# EAGLE design res (EAGLE 6.5.0)
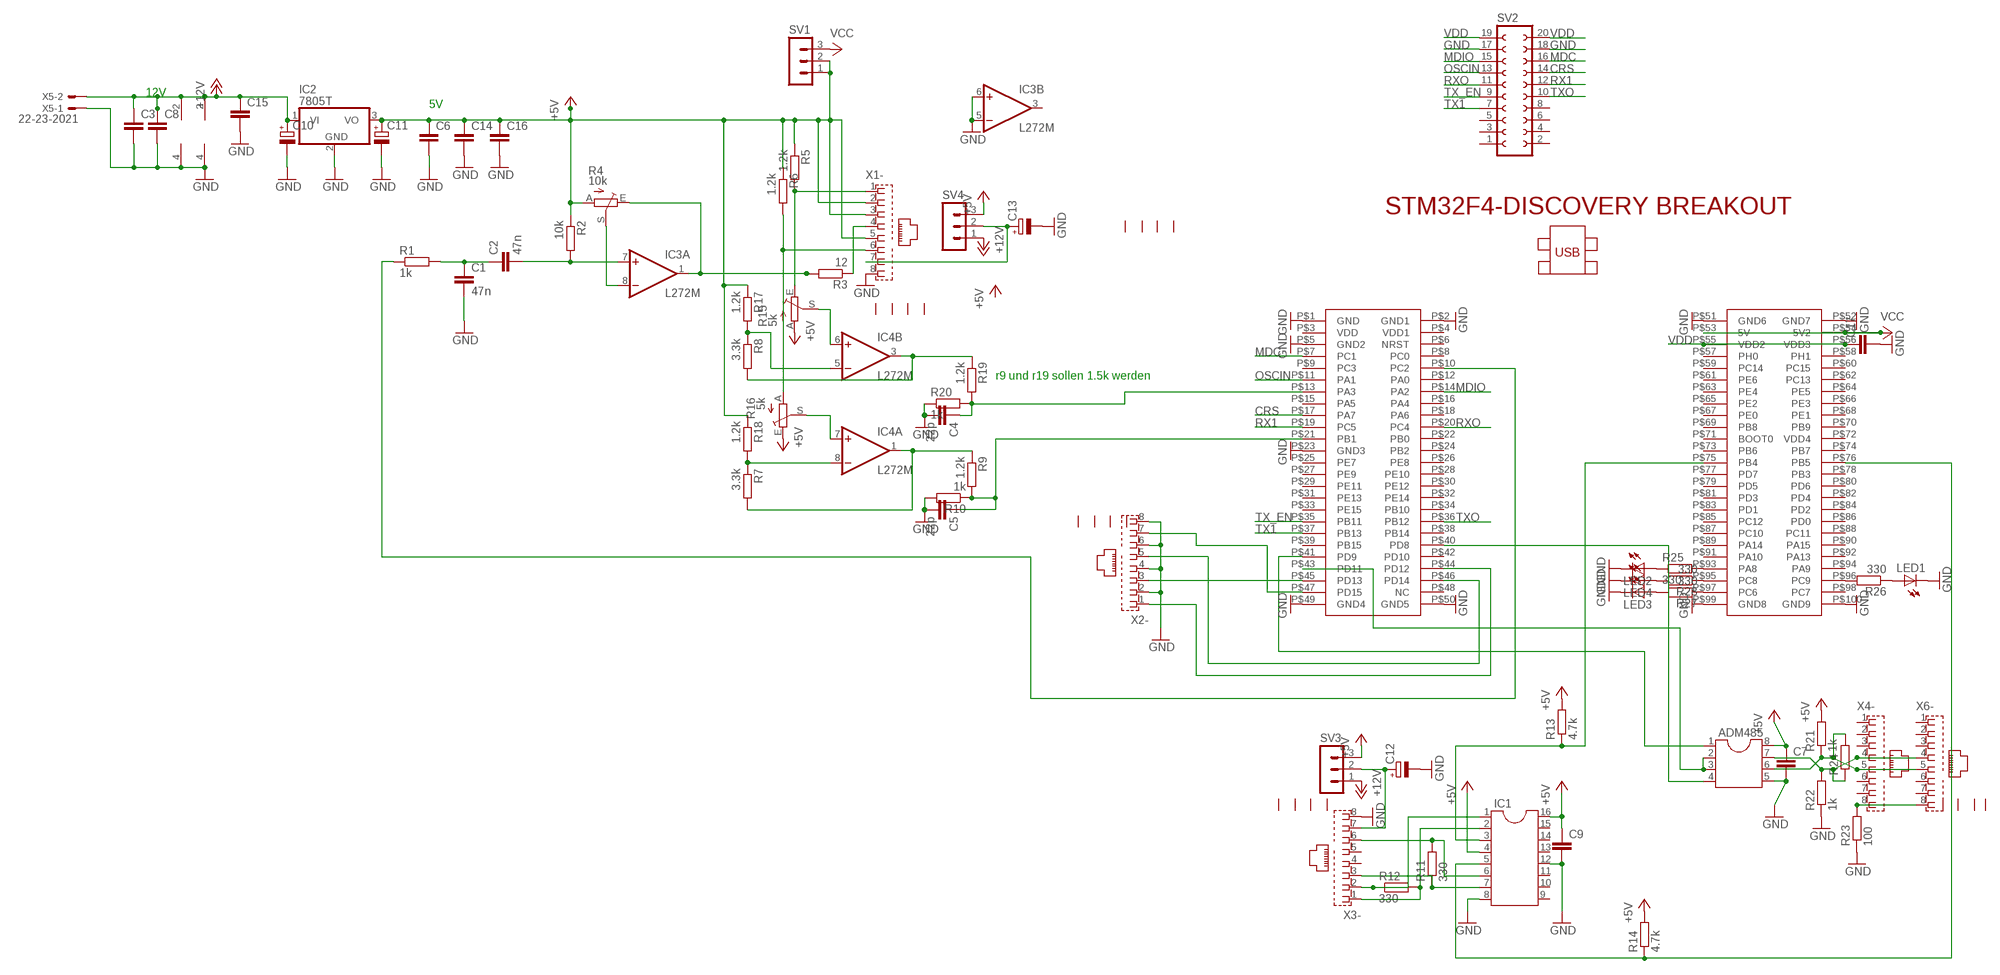
[diagram p0: schematic, sheet 1]

## Parts
ADM485  DIL8  [DIL08]
C1  47n  C-EU050-025X075  [C050-025X075]
C2  47n  C-EU050-025X075  [C050-025X075]
C3  C-EU050-025X075  [C050-025X075]
C4  22p  C-EU050-025X075  [C050-025X075]
C5  22p  C-EU050-025X075  [C050-025X075]
C6  C-EU050-025X075  [C050-025X075]
C7  C-EU050-025X075  [C050-025X075]
C8  C-EU050-025X075  [C050-025X075]
C9  C-EU050-025X075  [C050-025X075]
C10  CPOL-EUE2.5-5  [E2,5-5]
C11  CPOL-EUE2.5-5  [E2,5-5]
C12  CPOL-EUE2.5-5  [E2,5-5]
C13  CPOL-EUE2.5-5  [E2,5-5]
C14  C-EU050-025X075  [C050-025X075]
C15  C-EU050-025X075  [C050-025X075]
C16  C-EU050-025X075  [C050-025X075]
C17  C-EU050-025X075  [C050-025X075]
IC1  DIL16  [DIL16]
IC2  7805T  [TO220H]
IC3  L272M  [DIL08]
IC4  L272M  [DIL08]
LED1  LED3MM  [LED3MM]
LED2  LED3MM  [LED3MM]
LED3  LED3MM  [LED3MM]
LED4  LED3MM  [LED3MM]
R1  1k  R-EU_0204/7  [0204/7]
R2  10k  R-EU_0204/7  [0204/7]
R3  12  R-EU_0204/7  [0204/7]
R4  10k  TRIM_EU-CA6V  [CA6V]
R5  1.2k  R-EU_0204/7  [0204/7]
R6  1.2k  R-EU_0204/7  [0204/7]
R7  3.3k  R-EU_0204/7  [0204/7]
R8  3.3k  R-EU_0204/7  [0204/7]
R9  1.2k  R-EU_0204/7  [0204/7]
R10  1k  R-EU_0204/7  [0204/7]
R11  330  R-EU_0204/7  [0204/7]
R12  330  R-EU_0204/7  [0204/7]
R13  4.7k  R-EU_0204/7  [0204/7]
R14  4.7k  R-EU_0204/7  [0204/7]
R15  5k  TRIM_EU-CA6V  [CA6V]
R16  5k  TRIM_EU-CA6V  [CA6V]
R17  1.2k  R-EU_0204/7  [0204/7]
R18  1.2k  R-EU_0204/7  [0204/7]
R19  1.2k  R-EU_0204/7  [0204/7]
R20  1k  R-EU_0204/7  [0204/7]
R21  1k  R-EU_0204/7  [0204/7]
R22  1k  R-EU_0204/7  [0204/7]
R23  100  R-EU_0204/7  [0204/7]
R24  R-EU_0204/7  [0204/7]
R25  330  R-EU_0204/7  [0204/7]
R26  330  R-EU_0204/7  [0204/7]
R27  330  R-EU_0204/7  [0204/7]
R28  330  R-EU_0204/7  [0204/7]
SV1  MA03-1  [MA03-1]
SV2  FE10-2W  [FE10-2W]
SV3  MA03-1  [MA03-1]
SV4  MA03-1  [MA03-1]
U$1  STM32F4-DISCOVERY  [STM32F4-DISCOVERY]
X1  RJ45  [RJ45]
X2  RJ45  [RJ45]
X3  RJ45  [RJ45]
X4  RJ45  [RJ45]
X5  22-23-2021  [22-23-2021]
X6  RJ45  [RJ45]

## Nets
+5V: ADM485.8 C6.1 C7.1 C9.1 C11.+ C14.1 C16.1 IC1.4 IC1.16 IC2.3(VO) R2.1 R4.A R5.1 R6.1 R13.2 R14.2 R15.A R16.E R17.1 R18.1 R21.2 SV1.1 SV1.2 SV3.3 SV4.3 X1.2 X1.3 X1.5
+12V: C3.1 C8.1 C10.+ C15.1 IC2.1(VI) IC3.2(P:V+) IC4.2(P:V+) SV3.1 SV4.1 X5.2
CRS: SV2.14 U$1.P$17(PA7)
GND: ADM485.5 C1.2 C3.2 C4.2 C5.2 C6.2 C7.2 C8.2 C9.2 C10.- C11.- C12.- C13.- C14.2 C15.2 C16.2 C17.2 IC1.8 IC1.12 IC2.2(GND) IC3.4(P:GND) IC3.5(B:-IN) IC3.6(B:+IN) IC4.4(P:GND) LED1.K(C) LED2.K(C) LED3.K(C) LED4.K(C) R10.2 R20.1 R22.1 R23.1 SV2.17 SV2.18 U$1.P$1(GND) U$1.P$2(GND1) U$1.P$5(GND2) U$1.P$23(GND3) U$1.P$49(GND4) U$1.P$50(GND5) U$1.P$51(GND6) U$1.P$52(GND7) U$1.P$99(GND8) U$1.P$100(GND9) X1.8 X2.2 X2.4 X2.6 X2.8 X3.8 X5.1
MDC: SV2.16 U$1.P$7(PC1)
MDIO: SV2.15 U$1.P$14(PA2)
N$1: IC3.8(A:-IN) R4.S
N$2: IC3.1(A:OUT) R3.2 R4.E
N$3: C2.2 IC3.7(A:+IN) R2.2
N$4: R1.1 U$1.P$10(PC2)
N$5: C1.1 C2.1 R1.2
N$6: R3.1 X1.4
N$8: R6.2 R16.A X1.6
N$9: R5.2 R15.E X1.1
N$10: IC4.5(B:-IN) R8.1 R17.2
N$11: IC4.8(A:-IN) R7.1 R18.2
N$12: IC4.3(B:OUT) R8.2 R19.1
N$13: IC4.1(A:OUT) R7.2 R9.1
N$14: U$1.P$47(PD15) X2.7
N$15: C12.+ SV3.2 X3.7
N$16: U$1.P$44(PD12) X2.1
N$17: IC1.6 R11.2 X3.6
N$18: U$1.P$46(PD14) X2.5
N$19: U$1.P$45(PD13) X2.3
N$20: C4.1 R19.2 R20.2 U$1.P$13(PA3)
N$21: IC4.6(B:+IN) R15.S
N$22: IC1.3 R13.1 U$1.P$75(PB4)
N$23: IC1.5 R14.1 U$1.P$76(PB5)
N$24: IC1.2 R12.2 X3.1
N$25: IC1.1 R12.1 X3.2
N$26: IC1.7 R11.1 X3.3
N$27: C13.+ SV4.2 X1.7
N$28: IC4.7(A:+IN) R16.S
N$37: ADM485.4 U$1.P$40(PD8)
N$40: C5.1 R9.2 R10.1 U$1.P$21(PB1)
N$41: ADM485.1 U$1.P$41(PD9)
N$42: ADM485.2 ADM485.3 U$1.P$43(PD11)
N$43: ADM485.6 R21.1 R24.2 X4.5 X6.5
N$44: ADM485.7 R22.2 R24.1 X4.4 X6.4
N$45: R23.2 X4.8 X6.8
N$46: LED2.A R25.1
N$47: R26.2 U$1.P$96(PC9)
N$48: R27.1 U$1.P$97(PC6)
N$49: R28.1 U$1.P$95(PC8)
N$50: LED1.A R26.1
N$51: R25.2 U$1.P$93(PA8)
N$52: LED3.A R27.2
N$53: LED4.A R28.2
OSCIN: SV2.13 U$1.P$11(PA1)
RX1: SV2.12 U$1.P$19(PC5)
RXO: SV2.11 U$1.P$20(PC4)
TX1: SV2.7 U$1.P$37(PB13)
TX_EN: SV2.9 U$1.P$35(PB11)
TXO: SV2.10 U$1.P$36(PB12)
VCC: SV1.3 U$1.P$53(5V) U$1.P$54(5V2)
VDD: C17.1 SV2.19 SV2.20 U$1.P$55(VDD2) U$1.P$56(VDD3)
Unconnected: IC1.9 IC1.10 IC1.11 IC1.13 IC1.14 IC1.15 IC3.3(B:OUT) SV2.1 SV2.2 SV2.3 SV2.4 SV2.5 SV2.6 SV2.8 U$1.P$3(VDD) U$1.P$4(VDD1) U$1.P$6(NRST) U$1.P$8(PC0) U$1.P$9(PC3) U$1.P$12(PA0) U$1.P$15(PA5) U$1.P$16(PA4) U$1.P$18(PA6) U$1.P$22(PB0) U$1.P$24(PB2) U$1.P$25(PE7) U$1.P$26(PE8) U$1.P$27(PE9) U$1.P$28(PE10) U$1.P$29(PE11) U$1.P$30(PE12) U$1.P$31(PE13) U$1.P$32(PE14) U$1.P$33(PE15) U$1.P$34(PB10) U$1.P$38(PB14) U$1.P$39(PB15) U$1.P$42(PD10) U$1.P$48(NC) U$1.P$57(PH0) U$1.P$58(PH1) U$1.P$59(PC14) U$1.P$60(PC15) U$1.P$61(PE6) U$1.P$62(PC13) U$1.P$63(PE4) U$1.P$64(PE5) U$1.P$65(PE2) U$1.P$66(PE3) U$1.P$67(PE0) U$1.P$68(PE1) U$1.P$69(PB8) U$1.P$70(PB9) U$1.P$71(BOOT0) U$1.P$72(VDD4) U$1.P$73(PB6) U$1.P$74(PB7) U$1.P$77(PD7) U$1.P$78(PB3) U$1.P$79(PD5) U$1.P$80(PD6) U$1.P$81(PD3) U$1.P$82(PD4) U$1.P$83(PD1) U$1.P$84(PD2) U$1.P$85(PC12) U$1.P$86(PD0) U$1.P$87(PC10) U$1.P$88(PC11) U$1.P$89(PA14) U$1.P$90(PA15) U$1.P$91(PA10) U$1.P$92(PA13) U$1.P$94(PA9) U$1.P$98(PC7) X1.G1 X1.G2 X1.G3 X1.G4 X2.G1 X2.G2 X2.G3 X2.G4 X3.4 X3.5 X3.G1 X3.G2 X3.G3 X3.G4 X4.1 X4.2 X4.3 X4.6 X4.7 X4.G1 X4.G2 X4.G3 X4.G4 X6.1 X6.2 X6.3 X6.6 X6.7 X6.G1 X6.G2 X6.G3 X6.G4

## Notes on the sheet
- 12V
- 5V
- r9 und r19 sollen 1.5k werden

## Library data of the parts
ADM485 = ic-package:DIL8: Dual In Line / Socket
C1-C9 C14-C17 = rcl:C-EU: CAPACITOR, European symbol
C10-C13 = rcl:CPOL-EU: POLARIZED CAPACITOR, European symbol
IC1 = ic-package:DIL16: Dual In Line / Socket
IC2 = linear:78*: Positive VOLTAGE REGULATOR Source: http://cache.national.com/ds/LM/LM78L05.pdf http://www.fairchildsemi.com/ds/LM/LM7805.pdf
IC3 IC4 = linear:L272: OP AMP
LED1-LED4 = led:LED: LED OSRAM: - CHIPLED LG R971, LG N971, LY N971, LG Q971, LY Q971, LO R971, LY R971 LH N974, LH R974 LS Q976, LO Q976, LY Q976 LO Q996 - Hyper CHIPLED LW Q18S LB Q993, LB Q99A, LB R99A - SideLED LS A670, LO A670, LY A670, LG A670, LP A670 LB A673, LV A673, LT A673, LW A673 LH A674 LY A675 LS A676, LA A676, LO A676, LY A676, LW A676 LS A679, LY A679, LG A679 - Hyper Micro SIDELED® LS Y876, LA Y876, LO Y876, LY Y876 LT Y87S - SmartLED LW L88C, LW L88S LB L89C, LB L89S, LG L890 LS L89K, LO L89K, LY L89K LS L896, LA L896, LO L896, LY L896 - TOPLED LS T670, LO T670, LY T670, LG T670, LP T670 LSG T670, LSP T670, LSY T670, LOP T670, LYG T670 LG T671, LOG T671, LSG T671 LB T673, LV T673, LT T673, LW T673 LH T674 LS T676, LA T676, LO T676, LY T676, LB T676, LH T676, LSB T676, LW T676 LB T67C, LV T67C, LT T67C, LS T67K, LO T67K, LY T67K, LW E67C LS E67B, LA E67B, LO E67B, LY E67B, LB E67C, LV E67C, LT E67C LW T67C LS T679, LY T679, LG T679 LS T770, LO T770, LY T770, LG T770, LP T770 LB T773, LV T773, LT T773, LW T773 LH T774 LS E675, LA E675, LY E675, LS T675 LS T776, LA T776, LO T776, LY T776, LB T776 LHGB T686 LT T68C, LB T68C - Hyper Mini TOPLED® LB M676 - Mini TOPLED Santana® LG M470 LS M47K, LO M47K, LY M47K Source: http://www.osram.convergy.de LUXEON: - LUMILED® LXK2-PW12-R00, LXK2-PW12-S00, LXK2-PW14-U00, LXK2-PW14-V00 LXK2-PM12-R00, LXK2-PM12-S00, LXK2-PM14-U00 LXK2-PE12-Q00, LXK2-PE12-R00, LXK2-PE12-S00, LXK2-PE14-T00, LXK2-PE14-U00 LXK2-PB12-K00, LXK2-PB12-L00, LXK2-PB12-M00, LXK2-PB14-N00, LXK2-PB14-P00, LXK2-PB14-Q00 LXK2-PR12-L00, LXK2-PR12-M00, LXK2-PR14-Q00, LXK2-PR14-R00 LXK2-PD12-Q00, LXK2-PD12-R00, LXK2-PD12-S00 LXK2-PH12-R00, LXK2-PH12-S00 LXK2-PL12-P00, LXK2-PL12-Q00, LXK2-PL12-R00 Source: www.luxeon.com KINGBRIGHT: KA-3528ASYC Source: www.kingbright.com
R1-R3 R5-R14 R17-R28 = resistor:R-EU_: RESISTOR, European symbol
R4 R15 R16 = pot:TRIM_EU-: POTENTIOMETER
SV1 SV3 SV4 = con-lstb:MA03-1: PIN HEADER; OC_FARNELL: unknown; OC_NEWARK: unknown
SV2 = con-lsta:FE10-2W: FEMALE HEADER; OC_FARNELL: unknown; OC_NEWARK: unknown
U$1 = STM32F4-DISCOVERY:STM32F4-DISCOVERY
X1-X4 X6 = con-appsys:RJ45: AMP connector
X5 = con-molex:22-23-2021: .100" (2.54mm) Center Header - 2 Pin; MF: MOLEX; MPN: 22-23-2021; OC_FARNELL: 1462926; OC_NEWARK: 25C3832

## Net classes
0 default: clearance 0.205 mm

## Board
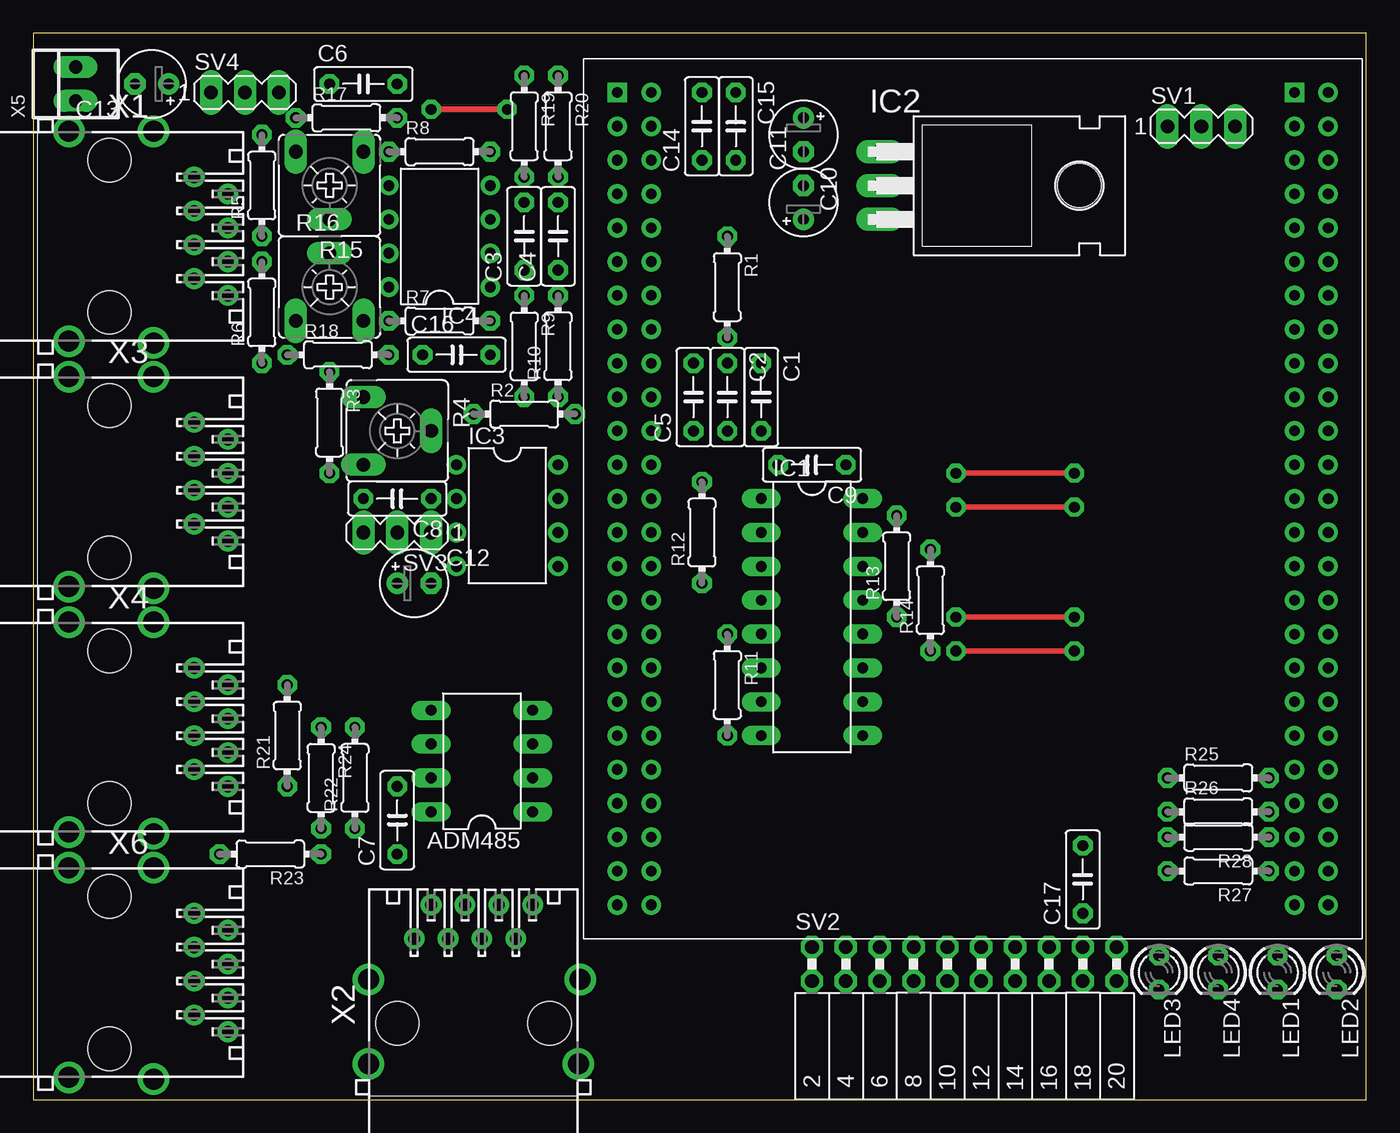
[diagram p1: board, top side]
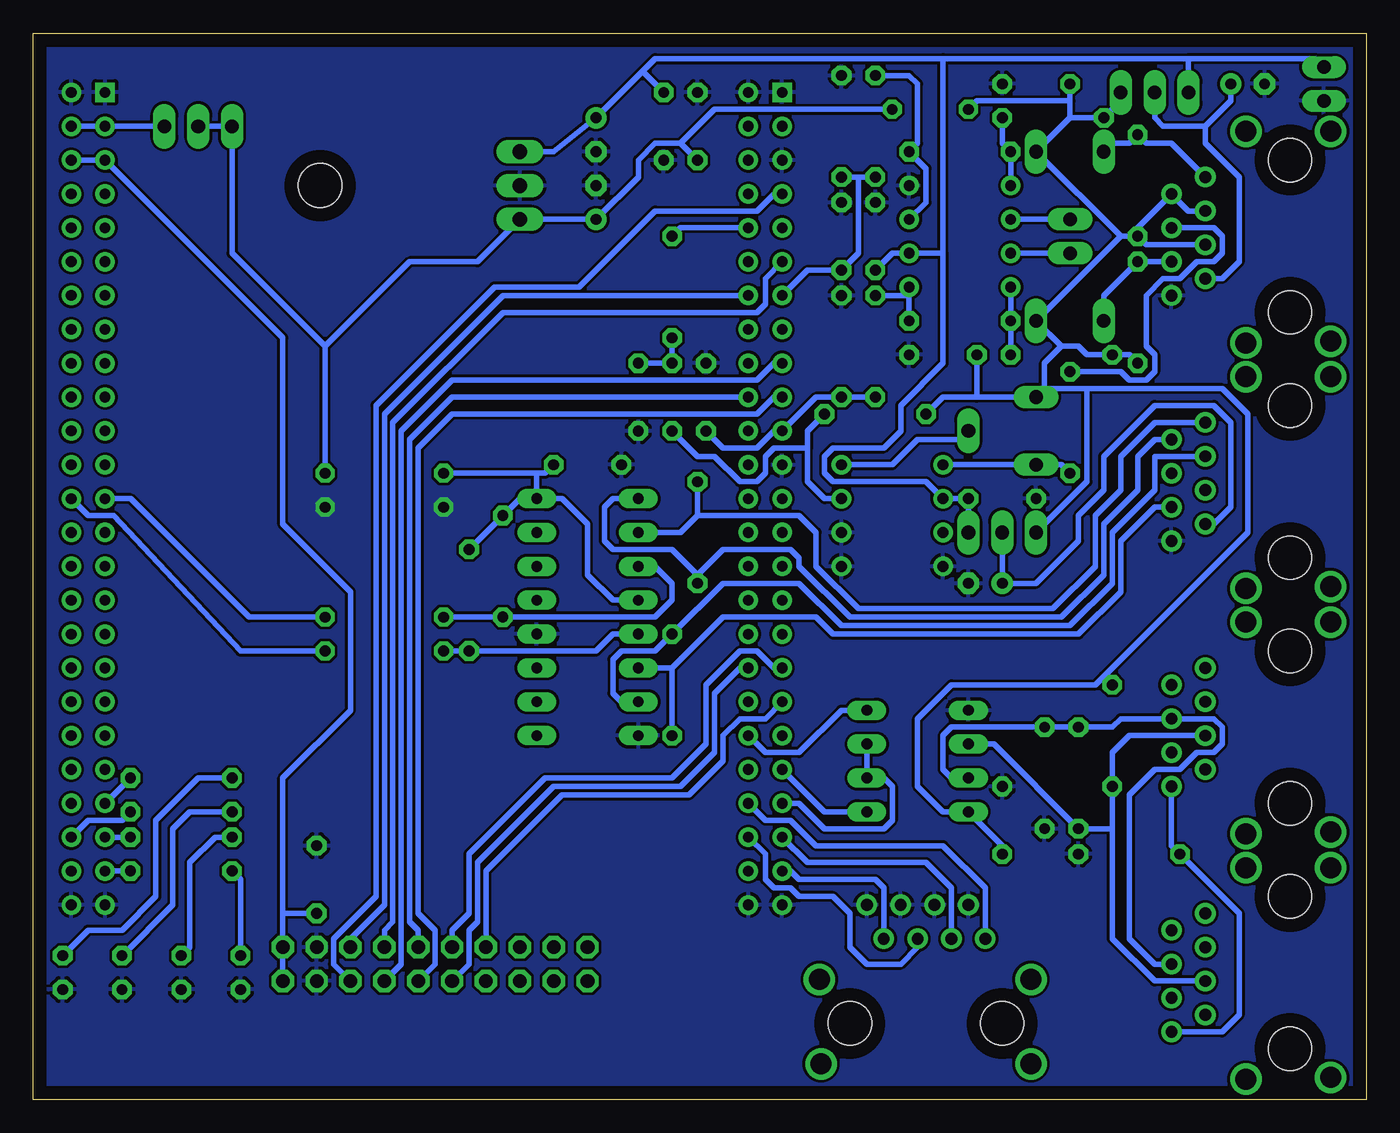
[diagram p2: board, bottom side, seen from below]

Size 100 x 80 mm. Coordinates in mm from the lower left corner, seen from the top.
Outline: 0,0 100,0 100,80 0,80 0,0
Copper layers (1*16): Top 0.035mm / dielectric 1.5mm / Bottom 0.035mm
Design rules "default *": minimum track width 10mil, minimum drill 31mil, track to track 8mil, track to pad 8mil, pad to pad 8mil, via to via 8mil, smd to smd 8mil, copper to edge 40mil, drill to drill 8mil, minimum pad ring 13mil, minimum via ring 8mil, stop-mask expansion 4mil, vias tented up to drill 0mil, thermal gap 10mil

### Footprints (pad centres in the part's own frame; a part is rotated, then mirrored left to right if it is on the bottom)
DIL08 = drill 0.813 long: 1 -3.81,-3.81; 2 -1.27,-3.81; 3 1.27,-3.81; 4 3.81,-3.81; 5 3.81,3.81; 6 1.27,3.81; 7 -1.27,3.81; 8 -3.81,3.81
C050-025X075 = drill 0.813 octagon: 1 -2.54,0; 2 2.54,0
E2,5-5 = drill 0.813 pad 1.6: + -1.27,0 | drill 0.813 pad 1.6 octagon: - 1.27,0
DIL16 = drill 0.813 long: 1 -8.89,-3.81; 2 -6.35,-3.81; 3 -3.81,-3.81; 4 -1.27,-3.81; 5 1.27,-3.81; 6 3.81,-3.81; 7 6.35,-3.81; 8 8.89,-3.81; 9 8.89,3.81; 10 6.35,3.81; 11 3.81,3.81; 12 1.27,3.81; 13 -1.27,3.81; 14 -3.81,3.81; 15 -6.35,3.81; 16 -8.89,3.81
TO220H = drill 1.118 long: 1 -2.54,-10.16; 2 0,-10.16; 3 2.54,-10.16 | hole 3.302: 0,4.826
DIL08' = drill 0.813 pad 1.27: 1 -3.81,-3.81; 2 -1.27,-3.81; 3 1.27,-3.81; 4 3.81,-3.81; 5 3.81,3.81; 6 1.27,3.81; 7 -1.27,3.81; 8 -3.81,3.81
LED3MM = drill 0.813 octagon: A -1.27,0; K 1.27,0
0204/7 = drill 0.813 octagon: 1 -3.81,0; 2 3.81,0
CA6V = drill 1.016 long: A -2.54,-2.54; E 2.54,-2.54; S 0,2.54
MA03-1 = drill 1.016 long: 1 -2.54,0; 2 0,0; 3 2.54,0
FE10-2W = drill 1.016 octagon: 1 -11.43,1.27; 2 -11.43,-1.27; 3 -8.89,1.27; 4 -8.89,-1.27; 5 -6.35,1.27; 6 -6.35,-1.27; 7 -3.81,1.27; 8 -3.81,-1.27; 9 -1.27,1.27; 10 -1.27,-1.27; 11 1.27,1.27; 12 1.27,-1.27; 13 3.81,1.27; 14 3.81,-1.27; 15 6.35,1.27; 16 6.35,-1.27; 17 8.89,1.27; 18 8.89,-1.27; 19 11.43,1.27; 20 11.43,-1.27
STM32F4-DISCOVERY = drill 0.8 square: P$1 -27.94,30.48; P$51 22.86,30.48 | drill 0.8: P$2 -25.4,30.48; P$3 -27.94,27.94; P$4 -25.4,27.94; P$5 -27.94,25.4; P$6 -25.4,25.4; P$7 -27.94,22.86; P$8 -25.4,22.86; P$9 -27.94,20.32; P$10 -25.4,20.32; P$11 -27.94,17.78; P$12 -25.4,17.78; P$13 -27.94,15.24; P$14 -25.4,15.24; P$15 -27.94,12.7; P$16 -25.4,12.7; P$17 -27.94,10.16; P$18 -25.4,10.16; P$19 -27.94,7.62; P$20 -25.4,7.62; P$21 -27.94,5.08; P$22 -25.4,5.08; P$23 -27.94,2.54; P$24 -25.4,2.54; P$25 -27.94,0; P$26 -25.4,0; P$27 -27.94,-2.54; P$28 -25.4,-2.54; P$29 -27.94,-5.08; P$30 -25.4,-5.08; P$31 -27.94,-7.62; P$32 -25.4,-7.62; P$33 -27.94,-10.16; P$34 -25.4,-10.16; P$35 -27.94,-12.7; P$36 -25.4,-12.7; P$37 -27.94,-15.24; P$38 -25.4,-15.24; P$39 -27.94,-17.78; P$40 -25.4,-17.78; P$41 -27.94,-20.32; P$42 -25.4,-20.32; P$43 -27.94,-22.86; P$44 -25.4,-22.86; P$45 -27.94,-25.4; P$46 -25.4,-25.4; P$47 -27.94,-27.94; P$48 -25.4,-27.94; P$49 -27.94,-30.48; P$50 -25.4,-30.48; P$52 25.4,30.48; P$53 22.86,27.94; P$54 25.4,27.94; P$55 22.86,25.4; P$56 25.4,25.4; P$57 22.86,22.86; P$58 25.4,22.86; P$59 22.86,20.32; P$60 25.4,20.32; P$61 22.86,17.78; P$62 25.4,17.78; P$63 22.86,15.24; P$64 25.4,15.24; P$65 22.86,12.7; P$66 25.4,12.7; P$67 22.86,10.16; P$68 25.4,10.16; P$69 22.86,7.62; P$70 25.4,7.62; P$71 22.86,5.08; P$72 25.4,5.08; P$73 22.86,2.54; P$74 25.4,2.54; P$75 22.86,0; P$76 25.4,0; P$77 22.86,-2.54; P$78 25.4,-2.54; P$79 22.86,-5.08; P$80 25.4,-5.08; P$81 22.86,-7.62; P$82 25.4,-7.62; P$83 22.86,-10.16; P$84 25.4,-10.16; P$85 22.86,-12.7; P$86 25.4,-12.7; P$87 22.86,-15.24; P$88 25.4,-15.24; P$89 22.86,-17.78; P$90 25.4,-17.78; P$91 22.86,-20.32; P$92 25.4,-20.32; P$93 22.86,-22.86; P$94 25.4,-22.86; P$95 22.86,-25.4; P$96 25.4,-25.4; P$97 22.86,-27.94; P$98 25.4,-27.94; P$99 22.86,-30.48; P$100 25.4,-30.48
RJ45 = drill 0.889: 1 -4.445,6.35; 2 -3.175,8.89; 3 -1.905,6.35; 4 -0.635,8.89; 5 0.635,6.35; 6 1.905,8.89; 7 3.175,6.35; 8 4.445,8.89 | drill 1.575 pad 2.184: G1 -7.874,-3.048; G2 7.874,-3.048; G3 -7.874,3.302; G4 8.001,3.302 | hole 3.251: -5.715,0; 5.715,0
22-23-2021 = drill 1 long: 1 -1.27,0; 2 1.27,0

### Placement (x,y rotation side)
ADM485  33.66,25.4 90 top
C1  54.61,52.7 270 top
C2  52.07,52.7 270 top
C3  36.83,64.77 90 top
C4  39.37,64.77 90 top
C5  49.53,52.7 90 top
C6  24.77,76.2 0 top
C7  27.3,20.96 90 top
C8  27.3,45.08 180 top
C9  58.42,47.62 180 top
C10  57.78,72.39 270 top
C11  57.78,67.31 90 top
C12  28.57,38.73 0 top
C13  8.89,76.2 180 top
C14  50.16,73.03 90 top
C15  52.7,73.03 270 top
C16  31.75,55.88 0 top
C17  78.74,16.51 90 top
IC1  58.42,36.2 270 top
IC2  73.66,68.58 270 top
IC3  L272M  [DIL08']  35.56,43.81 270 top
IC4  L272M  [DIL08']  30.48,64.77 90 top
LED1  93.34,9.53 270 top
LED2  97.79,9.53 270 top
LED3  84.45,9.53 270 top
LED4  88.9,9.53 270 top
R1  52.07,60.96 270 top
R2  36.83,51.43 0 top
R3  22.23,50.8 270 top
R4  27.3,50.16 270 top
R5  17.14,68.58 90 top
R6  17.14,59.05 90 top
R7  30.48,58.42 0 top
R8  30.48,71.12 0 top
R9  36.83,56.51 270 top
R10  39.37,56.51 90 top
R11  52.07,31.11 270 top
R12  50.16,42.54 90 top
R13  64.77,40 90 top
R14  67.31,37.46 90 top
R15  22.23,68.58 180 top
R16  22.23,60.96 0 top
R17  23.5,73.66 0 top
R18  22.86,55.88 0 top
R19  36.83,73.03 270 top
R20  39.37,73.03 270 top
R21  19.05,27.3 90 top
R22  24.13,24.13 90 top
R23  17.78,18.41 180 top
R24  21.59,24.13 270 top
R25  88.9,24.13 0 top
R26  88.9,21.59 0 top
R27  88.9,17.14 180 top
R28  88.9,19.68 180 top
SV1  87.63,73.03 0 top
SV2  69.85,10.16 0 top
SV3  27.3,42.54 180 top
SV4  15.88,75.56 0 top
U$1  71.75,45.08 0 top
X1  5.71,64.77 270 top
X2  33.02,5.71 0 top
X3  5.71,46.35 270 top
X4  5.71,27.94 270 top
X5  3.17,76.2 90 top
X6  5.71,9.53 270 top

### Tracks (layer width: path | path; a pad name or v marks a point on that pad's centre or on a via)
+5V  (via drill 0.8 pad 1.42)
  Top 0.406: v78.11,46.99 v69.22,46.99 | v35.56,74.3 v29.84,74.3
  Bottom 0.406: SV1.2 SV1.1 85.09,63.5 78.11,56.51 | IC1.16 62.23,46.99 | v69.22,46.99 62.23,46.99 | 62.23,46.99 61.59,46.99 C9.1 | IC1.16 63.5,45.08 R13.2 R14.2 | v78.11,46.99 78.11,56.51 | IC1.4 56.52,37.46 58.42,39.37 58.42,43.18 60.33,45.08 IC1.16 | X1.3 13.34,66.67 X1.2 17.78,64.77 | 17.78,64.77 18.41,64.77 | X1.5 16.51,64.14 R5.1 17.78,64.77 | R6.1 17.78,55.88 R18.1 20.95,55.88 21.59,56.51 22.86,56.51 | 22.23,73.66 22.23,74.93 | 22.23,74.93 C6.1 | SV3.3 20.95,46.35 20.95,53.34 | R2.1 31.75,52.7 29.21,52.7 | 78.11,56.51 71.75,62.87 66.67,62.87 IC2.3 C11.+ 54.61,69.22 54.61,70.48 53.34,71.76 51.44,71.76 | 19.68,31.75 20.32,31.11 31.11,31.11 33.66,28.57 33.66,23.5 31.75,21.59 ADM485.8 27.3,19.05 C7.1 | R21.2 19.68,31.75 | 19.68,31.75 8.89,42.54 8.89,51.43 10.79,53.34 20.95,53.34 | C14.1 51.44,71.76 | 51.44,71.76 48.9,74.3 v35.56,74.3 | SV4.3 18.41,74.93 R17.1 22.23,73.66 | 29.21,52.7 R4.A 24.13,53.34 | 20.95,53.34 24.13,53.34 | 24.13,53.34 24.13,55.24 22.86,56.51 | 22.23,74.93 29.21,74.93 v29.84,74.3 | C16.1 29.21,52.7 | 22.86,56.51 R16.E 18.41,64.77 | 22.23,73.66 R15.A 18.41,64.77
+12V
  Bottom 0.406: SV3.1 C8.1 IC3.2 33.02,46.35 40.01,46.35 40.64,46.99 40.64,48.26 40.01,48.89 36.2,48.89 34.92,50.16 34.92,52.07 31.75,55.24 31.75,63.5 | 31.75,63.5 31.75,78.11 | IC2.1 60.96,71.12 C10.+ 54.29,77.15 | 54.29,77.15 53.34,78.11 31.75,78.11 | 31.75,63.5 IC4.2 35.56,63.5 C3.1 | 31.75,78.11 13.34,78.11 | 13.34,78.11 SV4.1 | C15.1 54.29,77.15 | X5.2 3.81,78.11 13.34,78.11
CRS
  Bottom 0.406: SV2.14 72.39,10.16 72.39,50.16 68.58,53.97 45.72,53.97 44.45,55.24 U$1.P$17
GND  (via drill 0.8 pad 1.42)
  Top 0.406: v69.22,44.45 v78.11,44.45
  pour Bottom: 0,80.65 101.6,80.65 100.97,-0.64 -0.64,-0.64
MDC
  Bottom 0.406: SV2.16 77.47,10.16 77.47,12.07 74.3,15.24 74.3,52.07 65.41,60.96 59.05,60.96 53.34,66.67 45.72,66.67 44.45,67.95 U$1.P$7
MDIO
  Bottom 0.406: SV2.15 76.2,12.07 73.66,14.61 73.66,51.43 64.77,60.32 U$1.P$14
N$1
  Bottom 0.406: IC3.8 35.56,47.62 33.66,49.53 30.48,49.53 R4.S
N$2
  Bottom 0.406: R3.2 22.86,47.62 R4.E IC3.1
N$3
  Bottom 0.406: R2.2 41.91,50.16 41.91,48.89 | C2.2 50.16,48.26 48.9,48.26 46.99,46.35 45.72,46.35 45.09,46.99 45.09,48.26 44.45,48.89 41.91,48.89 | IC3.7 40.64,45.08 41.91,46.35 41.91,48.89
N$4
  Bottom 0.406: U$1.P$10 51.44,65.41 R1.1
N$5
  Bottom 0.406: C1.1 C2.1 R1.2
N$6
  Bottom 0.406: X1.4 11.43,65.41 10.79,64.77 10.79,63.5 11.43,62.87 12.7,62.87 13.97,61.59 15.24,61.59 16.51,60.32 16.51,56.51 15.88,55.88 15.88,54.61 16.51,53.97 17.78,53.97 18.41,54.61 R3.1
N$8
  Bottom 0.406: R16.A 19.68,60.32 R6.2 X1.6
N$9
  Bottom 0.406: X1.1 14.61,71.76 16.51,71.76 R5.2 17.78,71.76 19.05,71.76 R15.E
N$10
  Bottom 0.406: IC4.5 R8.1 27.3,71.76 R17.2
N$11
  Bottom 0.406: IC4.8 R7.1 R18.2
N$12
  Bottom 0.406: IC4.3 33.02,67.31 33.02,69.85 R8.2 33.66,71.76 33.66,76.2 34.29,76.84 R19.1
N$13
  Bottom 0.406: IC4.1 34.29,60.32 | 34.29,60.32 R7.2 | R9.1 34.29,60.32
N$14
  Bottom 0.406: X2.7 36.2,15.88 36.83,16.51 42.55,16.51 43.18,17.14 U$1.P$47
N$15
  Bottom 0.406: X3.7 11.43,43.18 10.16,44.45 10.16,50.8 11.43,52.07 15.88,52.07 19.68,48.26 19.68,45.72 21.59,43.81 21.59,41.91 24.77,38.73 C12.+ SV3.2
N$16
  Bottom 0.406: U$1.P$44 45.09,20.96 43.18,20.96 41.27,19.05 31.75,19.05 28.57,15.88 X2.1
N$17
  Bottom 0.406: X3.6 15.88,44.45 18.41,41.91 18.41,38.1 21.59,34.92 40.01,34.92 41.27,36.2 48.26,36.2 52.07,32.38 | 52.07,32.38 IC1.6 | R11.2 52.07,32.38
N$18
  Bottom 0.406: U$1.P$46 45.09,18.41 45.09,16.51 44.45,15.88 43.18,15.88 42.55,15.24 40.01,15.24 38.73,13.97 38.73,11.43 37.47,10.16 34.92,10.16 33.66,11.43 X2.5
N$19
  Bottom 0.406: U$1.P$45 41.91,17.78 33.02,17.78 31.11,15.88 X2.3
N$20
  Bottom 0.406: U$1.P$13 41.91,62.23 C4.1 38.1,63.5 38.1,69.22 | R19.2 38.1,69.22 | 38.1,69.22 R20.2
N$21
  Bottom 0.406: R15.S IC4.6
N$22  (via drill 0.8 pad 1.42)
  Top 0.406: v69.22,36.2 v78.11,36.2
  Bottom 0.406: IC1.3 53.34,40 52.07,38.73 52.07,37.46 53.34,36.2 R13.1 v69.22,36.2 | v78.11,36.2 83.82,36.2 92.71,45.08 U$1.P$75
N$23  (via drill 0.8 pad 1.42)
  Top 0.406: v78.11,33.65 v69.22,33.65
  Bottom 0.406: U$1.P$76 95.89,43.81 93.98,43.81 84.45,33.65 v78.11,33.65 | v69.22,33.65 R14.1 57.78,33.65 56.52,34.92 IC1.5
N$24
  Bottom 0.406: X3.1 15.88,50.8 18.41,48.26 18.41,45.72 20.32,43.81 20.32,40 23.5,36.83 38.1,36.83 41.27,40 41.27,42.54 42.55,43.81 50.16,43.81 | 50.16,43.81 R12.2 | IC1.2 51.44,42.54 50.16,43.81
N$25
  Bottom 0.406: X3.2 15.88,49.53 17.14,48.26 17.14,45.72 19.68,43.18 19.68,39.37 22.86,36.2 38.73,36.2 42.55,40 42.55,40.64 43.18,41.27 48.26,41.27 50.16,39.37 | IC1.1 56.52,45.08 57.15,44.45 57.15,41.91 56.52,41.27 52.07,41.27 50.16,39.37 | R12.1 50.16,39.37
N$26
  Bottom 0.406: X3.3 15.88,48.26 15.88,45.72 19.05,42.54 19.05,38.73 22.23,35.56 39.37,35.56 42.55,38.73 48.26,38.73 R11.1 53.34,33.65 55.88,33.65 56.52,33.02 56.52,30.48 55.88,29.84 IC1.7
N$27
  Bottom 0.406: X1.7 10.79,61.59 9.53,62.87 9.53,69.22 12.06,71.76 12.06,73.03 | SV4.2 15.88,73.66 15.24,73.03 12.06,73.03 | 12.06,73.03 10.16,74.93 C13.+
N$28
  Bottom 0.406: R16.S IC4.7
N$37
  Bottom 0.406: ADM485.4 39.37,29.21 42.55,26.04 45.09,26.04 U$1.P$40
N$40
  Bottom 0.406: C5.1 48.26,48.89 45.72,48.89 44.45,50.16 U$1.P$21 41.27,52.7 R10.1 R9.2
N$41
  Bottom 0.406: ADM485.1 40.64,21.59 U$1.P$41
N$42
  Bottom 0.406: ADM485.3 ADM485.2 36.2,24.13 35.56,23.5 35.56,20.96 36.2,20.32 40.64,20.32 42.55,22.23 U$1.P$43
N$43
  Bottom 0.406: 19.05,20.32 R24.2 27.94,26.67 ADM485.6 | 19.05,20.32 19.05,12.07 15.88,8.89 X6.5 | 19.05,20.32 R21.1 19.05,26.04 17.78,27.3 X4.5
N$44
  Bottom 0.406: ADM485.7 31.11,24.13 31.75,24.77 31.75,27.3 31.11,27.94 R22.2 R24.1 19.05,27.94 18.41,28.57 X4.4 11.43,28.57 10.79,27.94 10.79,26.67 11.43,26.04 12.7,26.04 13.97,24.77 15.88,24.77 17.78,22.86 17.78,12.07 15.88,10.16 X6.4
N$45
  Bottom 0.406: X4.8 14.61,19.05 R23.2 9.53,13.97 9.53,6.35 10.79,5.08 X6.8
N$46
  Bottom 0.406: R25.1 87.63,24.13 90.81,20.96 90.81,15.24 93.34,12.7 95.89,12.7 LED2.A
N$47
  Bottom 0.406: R26.2 93.34,20.96 95.89,20.96 U$1.P$96
N$48
  Bottom 0.406: R27.1 U$1.P$97
N$49
  Bottom 0.406: U$1.P$95 R28.1
N$50
  Bottom 0.406: R26.1 88.27,21.59 89.53,20.32 89.53,14.61 LED1.A
N$51
  Bottom 0.406: R25.2 U$1.P$93
N$52
  Bottom 0.406: LED3.A 84.45,16.51 R27.2
N$53
  Bottom 0.406: R28.2 86.36,19.68 88.27,17.78 88.27,11.43 LED4.A
OSCIN
  Bottom 0.406: U$1.P$11 45.09,61.59 45.09,59.69 45.72,59.05 64.77,59.05 73.03,50.8 73.03,13.34 73.66,12.7 SV2.13
RX1
  Bottom 0.406: SV2.12 69.85,10.16 69.85,12.7 71.12,13.97 71.12,48.89 68.58,51.43 45.72,51.43 44.45,52.7 U$1.P$19
RXO
  Bottom 0.406: SV2.11 71.12,12.7 71.75,13.34 71.75,49.53 68.58,52.7 U$1.P$20
TX1
  Bottom 0.406: U$1.P$37 45.09,28.57 46.99,28.57 48.26,27.3 48.26,25.4 50.8,22.86 60.33,22.86 66.04,17.14 SV2.7
TX_EN
  Bottom 0.406: U$1.P$35 44.45,32.38 45.72,33.65 46.99,33.65 49.53,31.11 49.53,26.67 52.07,24.13 61.59,24.13 67.31,18.41 67.31,13.97 68.58,12.7 SV2.9
TXO
  Bottom 0.406: U$1.P$36 46.99,32.38 48.9,30.48 48.9,26.04 51.44,23.5 60.96,23.5 66.67,17.78 66.67,13.34 67.31,12.7 67.31,10.16 SV2.10
VCC
  Bottom 0.406: U$1.P$54 U$1.P$53 SV1.3
VDD
  Bottom 0.406: 81.28,13.97 81.28,24.13 76.2,29.21 76.2,38.1 81.28,43.18 81.28,57.15 U$1.P$55 U$1.P$56 | C17.1 81.28,13.97 | 81.28,13.97 SV2.19 SV2.20